# Altium project FishWantTip.PrjPcb
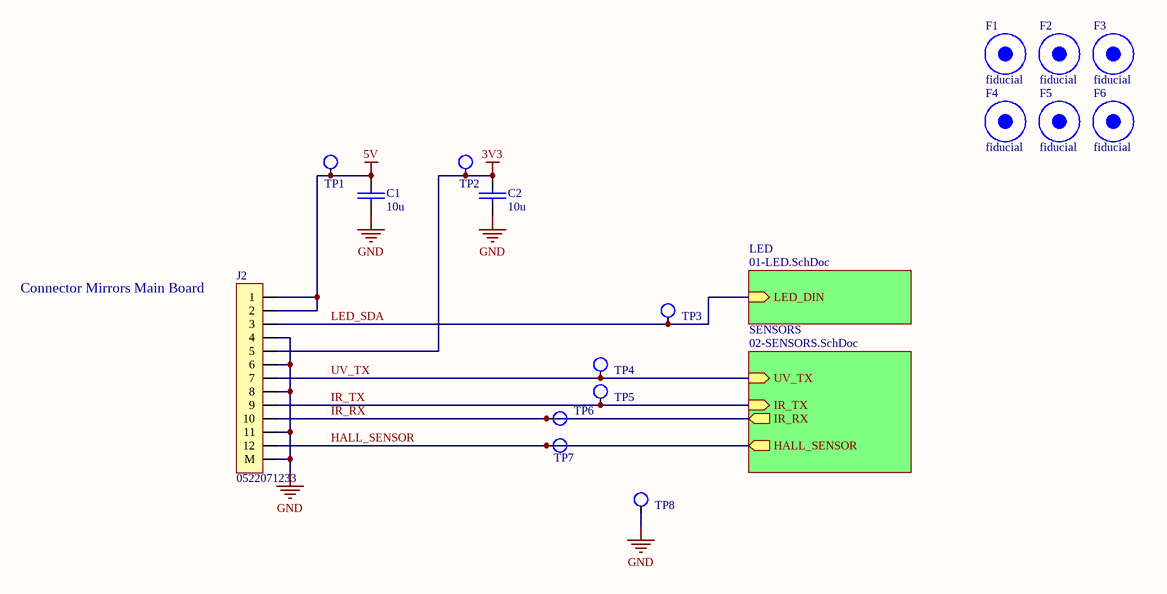
[diagram p0: 00-Top-layer.SchDoc]
3 sheets, 66 parts. Net scope: hierarchical (ports join the sheet entries above them; power ports are global).
Sheets:
  00-Top-layer.SchDoc
    LED = 01-LED.SchDoc
    SENSORS = 02-SENSORS.SchDoc

## Sheet 00-Top-layer.SchDoc
size A4

### Parts
C1  10u  [CAPC100X50X65]
C2  10u  [CAPC100X50X65]
F1  fiducial  [fiducial_marker]  (no BOM)
F2  fiducial  [fiducial_marker]  (no BOM)
F3  fiducial  [fiducial_marker]  (no BOM)
F4  fiducial  [fiducial_marker]  (no BOM)
F5  fiducial  [fiducial_marker]  (no BOM)
F6  fiducial  [fiducial_marker]  (no BOM)
J2  0522071233  [CONN_0522711279]
TP1  Test Point  [tp_1mm]  (value not drawn)  (no BOM)
TP2  Test Point  [tp_1mm]  (value not drawn)  (no BOM)
TP3  Test Point  [tp_1mm]  (value not drawn)  (no BOM)
TP4  Test Point  [tp_1mm]  (value not drawn)  (no BOM)
TP5  Test Point  [tp_1mm]  (value not drawn)  (no BOM)
TP6  Test Point  [tp_1mm]  (value not drawn)  (no BOM)
TP7  Test Point  [tp_1mm]  (value not drawn)  (no BOM)
TP8  Test Point  [tp_1mm]  (value not drawn)  (no BOM)

### Sub-sheets
LED = 01-LED.SchDoc: LED_DIN (in)
SENSORS = 02-SENSORS.SchDoc: IR_RX (out), UV_TX (in), HALL_SENSOR (out), IR_TX (in)

### Nets
3V3: C2.1 J2.5 TP2.1
5V: C1.1 J2.1 J2.2 TP1.1
GND: C1.2 C2.2 J2.4 J2.6 J2.8 J2.11 J2.M TP8.1
HALL_SENSOR: J2.12 TP7.1 ; sheet SENSORS/HALL_SENSOR
IR_RX: J2.10 TP6.1 ; sheet SENSORS/IR_RX
IR_TX: J2.9 TP5.1 ; sheet SENSORS/IR_TX
LED_SDA: J2.3 TP3.1 ; sheet LED/LED_DIN
UV_TX: J2.7 TP4.1 ; sheet SENSORS/UV_TX

### Notes on the sheet
- (near J2) Connector Mirrors Main Board

### Library data of the parts
C1 C2 = C_10UF_10V_X5R_0402: CAP CER 10UF 10V X5R 0402; Manufacturer: Samsung Electro-Mechanics; Manufacturer PN: CL05A106MP5NUNC; Supplier PN: 1276-1450-1-ND
F1-F6 = fiducial_marker
J2 = CONN_FPC_Bottom 12POS_1MM_0522711279: CONN FPC BOTTOM 12POS 1.00MM R/A; Manufacturer: Molex; Manufacturer PN: 0522711279; Supplier: Digi-Key; Supplier PN: WM7960CT-ND; Package / Case: *
TP1-TP8 = TP_1mm

## Sheet 01-LED.SchDoc
size A4
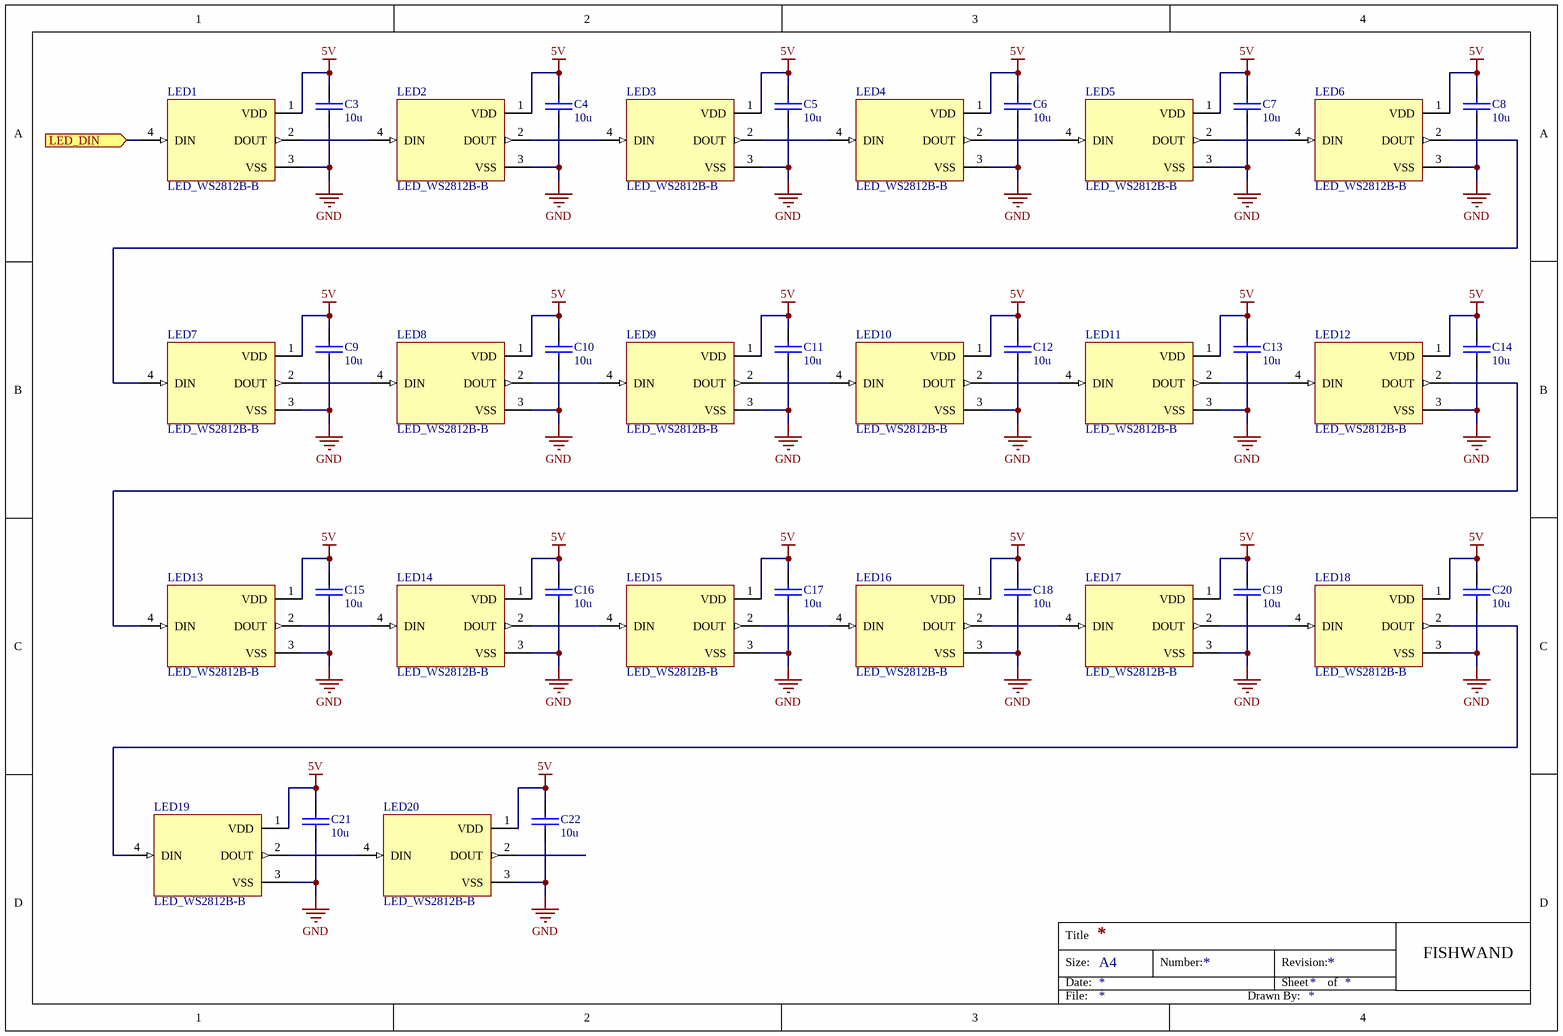
[diagram p1: 01-LED.SchDoc]

### Parts
C3  10u  [CAPC100X50X65]
C4  10u  [CAPC100X50X65]
C5  10u  [CAPC100X50X65]
C6  10u  [CAPC100X50X65]
C7  10u  [CAPC100X50X65]
C8  10u  [CAPC100X50X65]
C9  10u  [CAPC100X50X65]
C10  10u  [CAPC100X50X65]
C11  10u  [CAPC100X50X65]
C12  10u  [CAPC100X50X65]
C13  10u  [CAPC100X50X65]
C14  10u  [CAPC100X50X65]
C15  10u  [CAPC100X50X65]
C16  10u  [CAPC100X50X65]
C17  10u  [CAPC100X50X65]
C18  10u  [CAPC100X50X65]
C19  10u  [CAPC100X50X65]
C20  10u  [CAPC100X50X65]
C21  10u  [CAPC100X50X65]
C22  10u  [CAPC100X50X65]
LED1  LED_WS2812B-B  [LED_WS2812B-B]
LED2  LED_WS2812B-B  [LED_WS2812B-B]
LED3  LED_WS2812B-B  [LED_WS2812B-B]
LED4  LED_WS2812B-B  [LED_WS2812B-B]
LED5  LED_WS2812B-B  [LED_WS2812B-B]
LED6  LED_WS2812B-B  [LED_WS2812B-B]
LED7  LED_WS2812B-B  [LED_WS2812B-B]
LED8  LED_WS2812B-B  [LED_WS2812B-B]
LED9  LED_WS2812B-B  [LED_WS2812B-B]
LED10  LED_WS2812B-B  [LED_WS2812B-B]
LED11  LED_WS2812B-B  [LED_WS2812B-B]
LED12  LED_WS2812B-B  [LED_WS2812B-B]
LED13  LED_WS2812B-B  [LED_WS2812B-B]
LED14  LED_WS2812B-B  [LED_WS2812B-B]
LED15  LED_WS2812B-B  [LED_WS2812B-B]
LED16  LED_WS2812B-B  [LED_WS2812B-B]
LED17  LED_WS2812B-B  [LED_WS2812B-B]
LED18  LED_WS2812B-B  [LED_WS2812B-B]
LED19  LED_WS2812B-B  [LED_WS2812B-B]
LED20  LED_WS2812B-B  [LED_WS2812B-B]

### Ports
LED_DIN (in)

### Nets
5V: C3.1 C4.1 C5.1 C6.1 C7.1 C8.1 C9.1 C10.1 C11.1 C12.1 C13.1 C14.1 C15.1 C16.1 C17.1 C18.1 C19.1 C20.1 C21.1 C22.1 LED1.1(VDD) LED2.1(VDD) LED3.1(VDD) LED4.1(VDD) LED5.1(VDD) LED6.1(VDD) LED7.1(VDD) LED8.1(VDD) LED9.1(VDD) LED10.1(VDD) LED11.1(VDD) LED12.1(VDD) LED13.1(VDD) LED14.1(VDD) LED15.1(VDD) LED16.1(VDD) LED17.1(VDD) LED18.1(VDD) LED19.1(VDD) LED20.1(VDD)
GND: C3.2 C4.2 C5.2 C6.2 C7.2 C8.2 C9.2 C10.2 C11.2 C12.2 C13.2 C14.2 C15.2 C16.2 C17.2 C18.2 C19.2 C20.2 C21.2 C22.2 LED1.3(VSS) LED2.3(VSS) LED3.3(VSS) LED4.3(VSS) LED5.3(VSS) LED6.3(VSS) LED7.3(VSS) LED8.3(VSS) LED9.3(VSS) LED10.3(VSS) LED11.3(VSS) LED12.3(VSS) LED13.3(VSS) LED14.3(VSS) LED15.3(VSS) LED16.3(VSS) LED17.3(VSS) LED18.3(VSS) LED19.3(VSS) LED20.3(VSS)
LED_SDA: LED1.4(DIN) ; port LED_DIN
NetLED1_2: LED1.2(DOUT) LED2.4(DIN)
NetLED2_2: LED2.2(DOUT) LED3.4(DIN)
NetLED3_2: LED3.2(DOUT) LED4.4(DIN)
NetLED4_2: LED4.2(DOUT) LED5.4(DIN)
NetLED5_2: LED5.2(DOUT) LED6.4(DIN)
NetLED6_2: LED6.2(DOUT) LED7.4(DIN)
NetLED7_2: LED7.2(DOUT) LED8.4(DIN)
NetLED8_2: LED8.2(DOUT) LED9.4(DIN)
NetLED9_2: LED9.2(DOUT) LED10.4(DIN)
NetLED10_2: LED10.2(DOUT) LED11.4(DIN)
NetLED11_2: LED11.2(DOUT) LED12.4(DIN)
NetLED12_2: LED12.2(DOUT) LED13.4(DIN)
NetLED13_2: LED13.2(DOUT) LED14.4(DIN)
NetLED14_2: LED14.2(DOUT) LED15.4(DIN)
NetLED15_2: LED15.2(DOUT) LED16.4(DIN)
NetLED16_2: LED16.2(DOUT) LED17.4(DIN)
NetLED17_2: LED17.2(DOUT) LED18.4(DIN)
NetLED18_2: LED18.2(DOUT) LED19.4(DIN)
NetLED19_2: LED19.2(DOUT) LED20.4(DIN)

Not connected (* = marked no-connect by the designer): LED20 2(DOUT)

### Notes on the sheet
- Title
- Size:
- Date:
- A4
- Number:
- Revision:
- Sheet
- of
- FISHWAND
- File:
- Drawn By:

### Library data of the parts
C3-C22 = C_10UF_10V_X5R_0402: as C1 on sheet 00-Top-layer; Supplier PN: 1276-1450-1-ND
LED1-LED20 = LED_WS2812B-B: Intelligent control LED integrated light source; Manufacturer PN: WS2812B-V5; Manufacturer: Worldsemi; Package / Case: 5050; Value: *; Price: None; Availability: Unavailable

## Sheet 02-SENSORS.SchDoc: SENSORS
size A4; DrawnBy: Trevor Charmley; Engineer: Trevor Charmley; Revision: 1
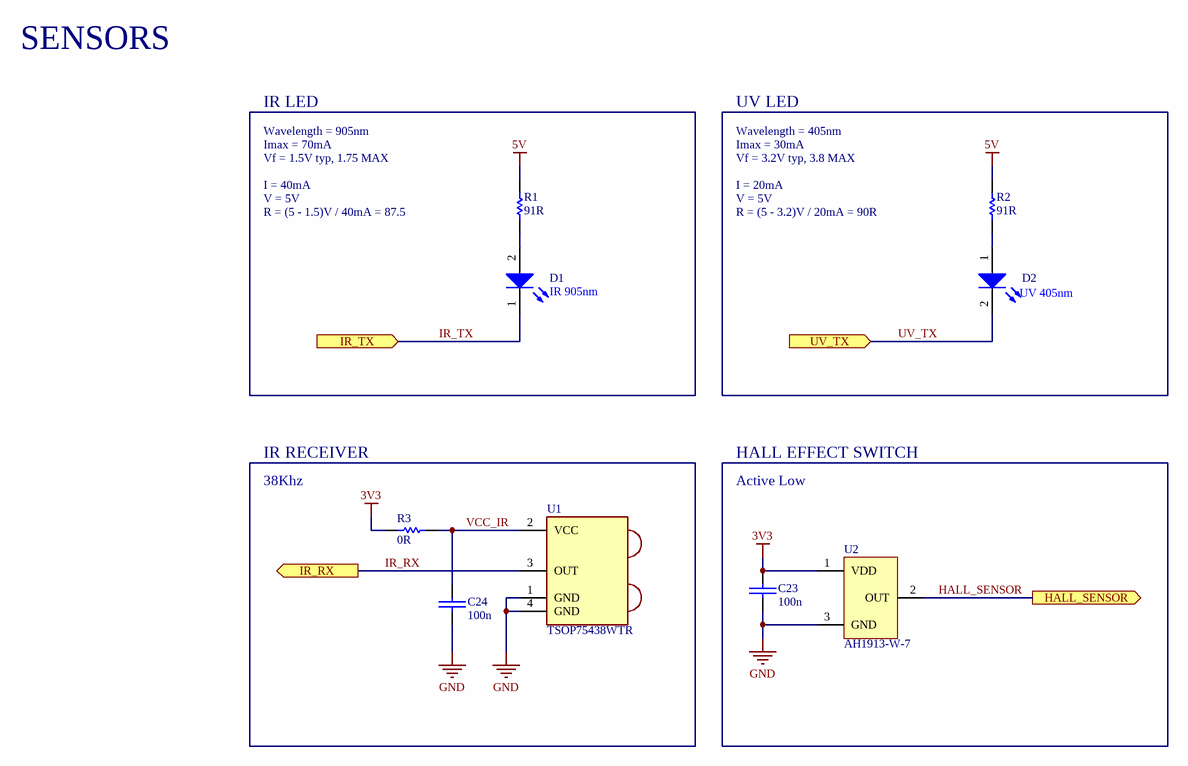
[diagram p2: 02-SENSORS.SchDoc]

### Parts
C23  100n  [CAPC100X50X65]
C24  100n  [CAPC100X50X65]
D1  value IR 905nm  [LED_SFH_4045N]  (hidden comment: LED)
D2  value UV 405nm  [LED_VLMU3100-GS08]  (hidden comment: LED)
R1  91R  [RESC0402]
R2  91R  [RESC0402]
R3  0R  [RESC0402]
U1  TSOP75438WTR  [TSOP75438WTR]
U2  AH1913-W-7  [SC59-3]

### Blocks framed on the sheet
IR LED: D1 R1
UV LED: D2 R2
IR RECEIVER: C24 R3 U1
HALL EFFECT SWITCH: C23 U2

### Ports
HALL_SENSOR (out), IR_RX (out), IR_TX (in), UV_TX (in)

### Nets
3V3: C23.1 R3.1 U2.1(VDD)
5V: R1.2 R2.2
GND: C23.2 C24.2 U1.1(GND) U1.4(GND) U2.3(GND)
HALL_SENSOR: U2.2(OUT) ; port HALL_SENSOR
IR_RX: U1.3(OUT) ; port IR_RX
IR_TX: D1.1 ; port IR_TX
UV_TX: D2.2(K) ; port UV_TX
VCC_IR: C24.1 R3.2 U1.2(VCC)
NetD1_2: D1.2 R1.1
NetD2_1: D2.1(A) R2.1

### Notes on the sheet
- SENSORS
- Imax = 70mA
- Wavelength = 905nm
- Imax = 30mA
- Wavelength = 405nm
- Vf = 1.5V typ, 1.75 MAX
- I = 40mA
- V = 5V
- R = (5 - 1.5)V / 40mA = 87.5
- Vf = 3.2V typ, 3.8 MAX
- I = 20mA
- R = (5 - 3.2)V / 20mA = 90R
- 38Khz
- Active Low
- Title
- Size:
- Date:
- A4
- Number:
- Revision:
- Sheet
- of
- FISHWAND
- File:
- Drawn By:

### Library data of the parts
C23 C24 = C_100NF_25V_X5R_0402: CAP CER 100nF 25V X5R 0402; Manufacturer: Murata Electronics; Manufacturer PN: GRM155R61E104KA87D; Supplier: Digi-Key; Supplier PN: 490-5920-2-ND
D1 = LED_SFH_4045N_IR_950nm: Infrared (IR) Emitter 950nm 1.6V 70mA 90mW/sr @ 70mA 18Â° 2-SMD, No Lead; Manufacturer PN: SFH 4045N; Manufacturer: OSRAM Opto; Purchase-URL: https://pricing.snapeda.com/search/part/SFH 4045N/?ref=eda; Package: SMT-2 OSRAM Opto; SnapEDA_Link: https://www.snapeda.com/parts/SFH%204045N/OSRAM%20Opto%20Semiconductors%20Inc./view-part/250024/?ref=snap; Check_prices: https://www.snapeda.com/parts/SFH%204045N/OSRAM%20Opto%20Semiconductors%20Inc./view-part/250024/?ref=eda; Digi-Key_Part_Number: 475-3047-1-ND
D2 = LED_VLMU3100-GS08_EMITTER_UV_405NM_30MA: Ultraviolet (UV) Emitter 405nm 3.2V 30mA 2.5mW/sr @ 20mA 120° 2-PLCC; Manufacturer: Vishay Semiconductor Opto Division; Package / Case: 2-PLCC; Manufacturer PN: VLMU3100-GS08; Price: None; Availability: Unavailable
R1 R2 = R_0402_90R_5%: 91 Ohms ±5% 0.063W, 1/16W Chip Resistor 0402 (1005 Metric) Moisture Resistant Thick Film; Manufacturer: YAGEO; Manufacturer PN: RC0402JR-0791RL; Supplier: Digi-Key; Supplier PN: 311-91JRCT-ND; Value: 91R; Tolerance: 5%; Package / Case: 0402
R3 = R_0402_0R_5%: 0 Ohms Jumper 0.063W, 1/16W Chip Resistor 0402 (1005 Metric) Thick Film; Manufacturer: YAGEO; Manufacturer PN: RC0402JR-070RP; Tolerance: 5%; Supplier: *; Supplier PN: *; Value: 0R; Package / Case: 0402
U1 = TSOP75438WTR_IR_38Khz_REMOTE: Remote Receiver Sensor 38.0kHz 45m Surface Mount; Manufacturer: Vishay Semiconductor Opto Division; Price: 2.08; Supplier PN: 751-TSOP75438WCT-ND; Manufacturer PN: TSOP75438WTR; Supplier: Digi-Key
U2 = U_MAG_SWITCH _AH1913-W-7: MAG SWITCH OMNIPOL SC59-3 T&R; Manufacturer: Diodes Incorporated; Manufacturer PN: AH1913-W-7; Supplier: Digi-Key; Supplier PN: SC-59-3; Package / Case: 0402

## Nets that join several sheets
3V3: 00-Top-layer (C2.1 J2.5 TP2.1), 02-SENSORS (C23.1 R3.1 U2.1)
5V: 00-Top-layer (C1.1 J2.1 J2.2 TP1.1), 01-LED (40 pins), 02-SENSORS (R1.2 R2.2)
GND: 00-Top-layer (8 pins), 01-LED (40 pins), 02-SENSORS (5 pins)
HALL_SENSOR: 00-Top-layer (J2.12 TP7.1), 02-SENSORS (U2.2)
IR_RX: 00-Top-layer (J2.10 TP6.1), 02-SENSORS (U1.3)
IR_TX: 00-Top-layer (J2.9 TP5.1), 02-SENSORS (D1.1)
LED_SDA: 00-Top-layer (J2.3 TP3.1), 01-LED (LED1.4)
UV_TX: 00-Top-layer (J2.7 TP4.1), 02-SENSORS (D2.2)

## Assembly variants
DevelopmentBoard: not fitted C13 C14 C15 C16 C17 C18 C19 C20 C21 C22